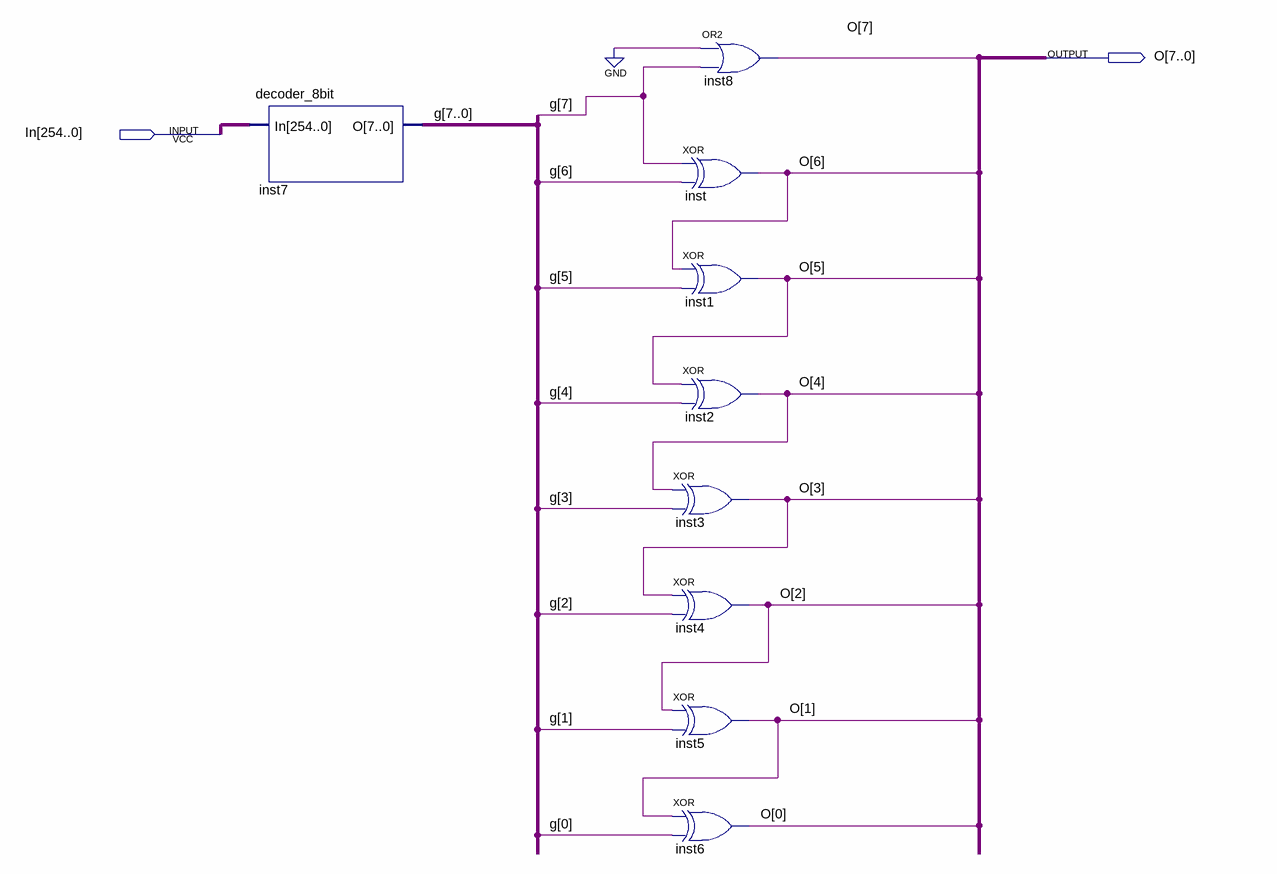
[diagram p0: schematic sheet]
// Quartus schematic final.bdf as structural Verilog: 9 symbols, 2 pins
module \final  (
  input  [254:0] In,
  output [7:0] O
);

  wire [7:0] g;

  decoder_8bit inst7 (.In(In), .O(g));
  xor inst3 (O[3], O[4], g[3]);
  xor inst4 (O[2], O[3], g[2]);
  xor inst5 (O[1], O[2], g[1]);
  xor inst6 (O[0], O[1], g[0]);
  or inst8 (O[7], 1'b0, g[7]);
  xor inst (O[6], g[7], g[6]);
  xor inst1 (O[5], O[6], g[5]);
  xor inst2 (O[4], O[5], g[4]);
endmodule
